# Altium schematic sheet IcantFindFileName.SchDoc
size A4; SheetNumber: 5; SheetTotal: 5
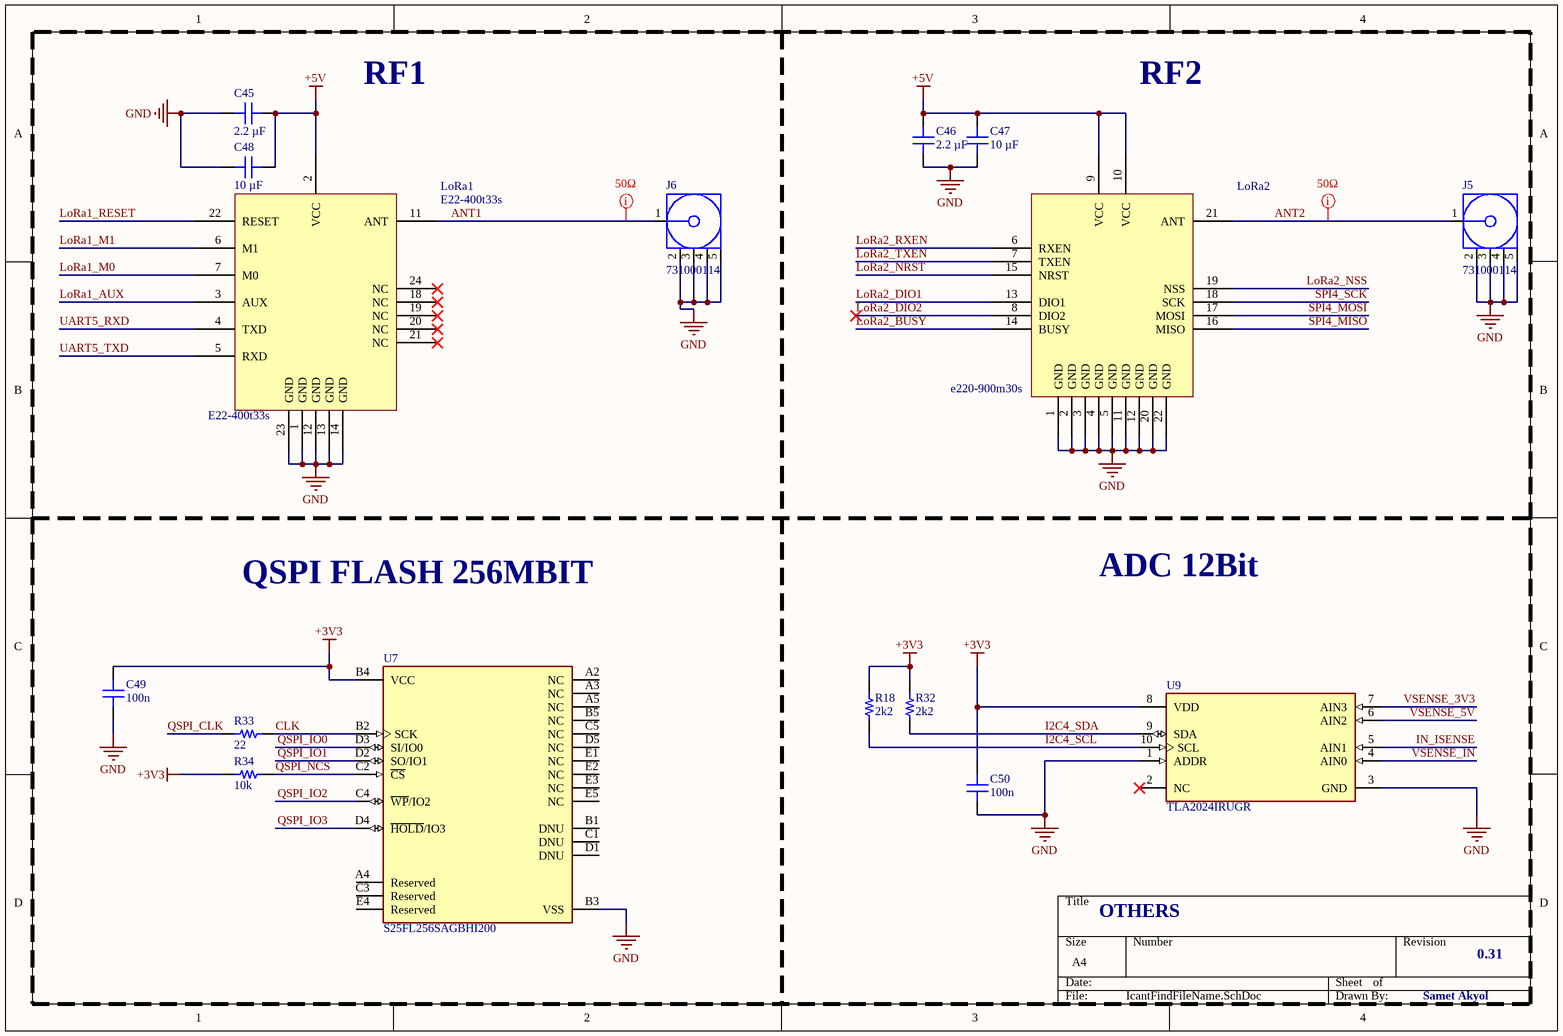
[diagram p0: IcantFindFileName.SchDoc]

## Parts
C45  2.2 µF  [CAP 0805_2012]
C46  2.2 µF  [CAP 0805_2012]
C47  10 µF  [CAP 0805_2012]
C48  10 µF  [CAP 0805_2012]
C49  100n  [CAP 0402_1005]
C50  100n  [CAP 0402_1005]
J5  731000114  [MOLX-731000114_V]
J6  731000114  [MOLX-731000114_V]
LoRa1  E22-400t33s  [E32-433T33S]
LoRa2  e220-900m30s  [PE220-900M30S]
R18  2k2  [RES 0402_1005]
R32  2k2  [RES 0402_1005]
R33  22  [RES 0402_1005]
R34  10k  [RES 0402_1005]
U7  S25FL256SAGBHI200  [FP-002-15534-MFG]
U9  TLA2024IRUGR  [FP-RUG0010A-MFG]

## Nets
+3V3: C49.2 C50.2 R18.2 R32.2 R34.2 U7.B4(VCC) U9.8(VDD)
+5V: C45.2 C46.2 C47.2 C48.2 LoRa1.2(VCC) LoRa2.9(VCC) LoRa2.10(VCC)
GND: C45.1 C46.1 C47.1 C48.1 C49.1 C50.1 J5.2 J5.3 J5.4 J5.5 J6.2 J6.3 J6.4 J6.5 LoRa1.1(GND) LoRa1.12(GND) LoRa1.13(GND) LoRa1.14(GND) LoRa1.23(GND) LoRa2.1(GND) LoRa2.2(GND) LoRa2.3(GND) LoRa2.4(GND) LoRa2.5(GND) LoRa2.11(GND) LoRa2.12(GND) LoRa2.20(GND) LoRa2.22(GND) U7.B3(VSS) U9.1(ADDR) U9.3(GND)
ANT1: J6.1 LoRa1.11(ANT)
ANT2: J5.1 LoRa2.21(ANT)
CLK: R33.2 U7.B2(SCK)
I2C4_SCL: R18.1 U9.10(SCL)
I2C4_SDA: R32.1 U9.9(SDA)
IN_ISENSE: U9.5(AIN1)
LoRa1_AUX: LoRa1.3(AUX)
LoRa1_M0: LoRa1.7(M0)
LoRa1_M1: LoRa1.6(M1)
LoRa1_RESET: LoRa1.22(RESET)
LoRa2_BUSY: LoRa2.14(BUSY)
LoRa2_DIO1: LoRa2.13(DIO1)
LoRa2_DIO2: LoRa2.8(DIO2)
LoRa2_NRST: LoRa2.15(NRST)
LoRa2_NSS: LoRa2.19(NSS)
LoRa2_RXEN: LoRa2.6(RXEN)
LoRa2_TXEN: LoRa2.7(TXEN)
QSPI_CLK: R33.1
QSPI_IO0: U7.D3(SI/IO0)
QSPI_IO1: U7.D2(SO/IO1)
QSPI_IO2: U7.C4(~{WP}/IO2)
QSPI_IO3: U7.D4(~{HOLD}/IO3)
QSPI_NCS: R34.1 U7.C2(~{CS})
SPI4_MISO: LoRa2.16(MISO)
SPI4_MOSI: LoRa2.17(MOSI)
SPI4_SCK: LoRa2.18(SCK)
UART5_RXD: LoRa1.4(TXD)
UART5_TXD: LoRa1.5(RXD)
VSENSE_3V3: U9.7(AIN3)
VSENSE_5V: U9.6(AIN2)
VSENSE_IN: U9.4(AIN0)

Not connected (* = marked no-connect by the designer): LoRa1 18(NC)* 19(NC)* 20(NC)* 21(NC)* 24(NC)*; U7 A2(NC) A3(NC) A4(Reserved) A5(NC) B1(DNU) B5(NC) C1(DNU) C3(Reserved) C5(NC) D1(DNU) D5(NC) E1(NC) E2(NC) E3(NC) E4(Reserved) E5(NC); U9 2(NC)*

## Layout directives
mark named 50Ω: ANT1, ANT2

## Notes on the sheet
- RF1
- RF2
- ADC 12Bit <www.google.com>
- QSPI FLASH 256MBIT
- OTHERS
- 0.31
- Samet Akyol

## Library data of the parts
C45 C46 = TMK212B7225MG-TR: CAP CER 2.2UF 25V X7R 0805; manufacturer: Taiyo Yuden; Tolerance: ±20%; Part Number: TMK212B7225MG-TR; Value: 2.2 µF; Applications: SMPS Filtering; Capacitance: 2.2 µF; componentlink1description: Datasheet; componentlink1url: https://www.yuden.co.jp/productdata/catalog/mlcc01_e.pdf; componentlink2description: DigiKey Link; componentlink2url: https://www.digikey.com/en/products/detail/taiyo-yuden/TMK212B7225MG-TR/6563525; Device Package: 0805 (2012 Metric); lastupdated: 9.02.2024 20:16:05; Lifecycle Status: Active; Minimum Order: 1; Mounting Type: Surface Mount, MLCC; Operating Temperature: -55°C ~ 125°C; Package / Case: 0805 (2012 Metric); packaging: TapeAndReel; partid: 3807; Part Status: Active; price: 0.04; series: M; Size / Dimension: 0.079" L x 0.049" W (2.00mm x 1.25mm); Supplier 1: DigiKey; Supplier Part Number 1: 587-4932-1-ND; Temperature Coefficient: X7R; Thickness (Max): 0.053" (1.35mm); Voltage - Rated: 25V
C47 C48 = C2012X6S1C106K125AC: CAP CER 10UF 16V X6S 0805; manufacturer: TDK Corporation; Tolerance: ±10%; Part Number: C2012X6S1C106K125AC; Value: 10 µF; Applications: General Purpose; Capacitance: 10 µF; componentlink1description: Datasheet; componentlink1url: https://product.tdk.com/info/en/catalog/datasheets/mlcc_commercial_general_en.pdf?ref_disty=digikey; componentlink2description: DigiKey Link; componentlink2url: https://www.digikey.com/en/products/detail/tdk-corporation/C2012X6S1C106K125AC/2733046; Device Package: 0805 (2012 Metric); Features: Low ESL; lastupdated: 9.02.2024 20:16:08; Lifecycle Status: Active; Minimum Order: 1; Mounting Type: Surface Mount, MLCC; Operating Temperature: -55°C ~ 105°C; Package / Case: 0805 (2012 Metric); packaging: TapeAndReel; partid: 2995; Part Status: Active; price: 0.06; series: C; Size / Dimension: 0.079" L x 0.049" W (2.00mm x 1.25mm); Supplier 1: DigiKey; Supplier Part Number 1: 445-7611-1-ND; Temperature Coefficient: X6S; Thickness (Max): 0.057" (1.45mm); Voltage - Rated: 16V
C49 C50 = CL05B104KP5VPNC: CAP CER 100NF 10V X7R 0402; manufacturer: Samsung Electro-Mechanics; Capacitance: 0.1 µF; Tolerance: ±10%; Part Number: CL05B104KP5VPNC; Value: 100n; Applications: Automotive; componentlink1description: Datasheet; componentlink1url: https://mm.digikey.com/Volume0/opasdata/d220001/medias/docus/5458/CL05B104KP5VPNC_Spec.pdf; componentlink2description: DigiKey Link; componentlink2url: https://www.digikey.com/en/products/detail/samsung-electro-mechanics/CL05B104KP5VPNC/20498482; Device Package: 0402 (1005 Metric); lastupdated: 9.02.2024 20:03:17; Lifecycle Status: Active; Minimum Order: 1; Mounting Type: Surface Mount, MLCC; Operating Temperature: -55°C ~ 125°C; Package / Case: 0402 (1005 Metric); packaging: TapeAndReel; partid: 56690; price: 0.01; Ratings: AEC-Q200; series: CL; Size / Dimension: 0.039" L x 0.020" W (1.00mm x 0.50mm); Supplier 1: DigiKey; Supplier Part Number 1: 1276-CL05B104KP5VPNCCT-ND; Temperature Coefficient: X7R; Thickness (Max): 0.022" (0.55mm); Voltage - Rated: 10V
J5 J6 = CMP-2000-05487-1: SMA Right-Angle PCB Jack Receptacle, Brass Body, Gold Plated, 50 Ohm, 5-Pin THD, RoHS, Tray; Manufacturer: Molex; Datasheet Version: 09/2016; Package Description: 5-Pin Through Hole Device, Body 14.8 x 6.35 mm, Pitch 2.54 mm; Datasheet URL: http://www.molex.com/webdocs/datasheets/pdf/en-us/0731000114_RF_COAX_CONNECTORS.pdf; Manufacturer URL: http://www.molex.com/; Package Reference: 731000114; Mounting Technology: ThroughHole; Package URL: http://www.molex.com/pdm_docs/sd/731000114_sd.pdf
LoRa1 = LoRa: (UART) based on SEMTECH's LoRa solution, with an operating frequency of 410.125~493.125MHz (default 433.125MHz), TTL level output, and is compatible with 3.3V and 5V IO port voltages.
LoRa2 = LoRaE220-900m30s: 1W module developed independently based on new generation of LoRa RF chip LLCC68 from Semtech. LLCC68 is suitable for 868MHz/915MHz
R18 R32 R34 = RP73PF1E10KBTD: RES 10K OHM 0.1% 1/10W 0402; Manufacturer: TE Connectivity Passive Product; Power (Watts): 0.1W, 1/10W; Resistance: 10 kOhms; Temperature Coefficient: ±25ppm/°C; Part Number: RP73PF1E10KBTD; ComponentLink1Description: Datasheet; ComponentLink1URL: https://www.te.com/commerce/DocumentDelivery/DDEController?Action=srchrtrv&DocNm=1773272&DocType=DS&DocLang=English; ComponentLink2Description: DigiKey Link; ComponentLink2URL: https://www.digikey.com/en/products/detail/te-connectivity-passive-product/RP73PF1E10KBTD/8260957; Composition: Thin Film; Device Package: 0402 (1005 Metric); Height - Seated (Max): 0.014" (0.35mm); LastUpdated: 9.02.2024 20:30:24; Lifecycle Status: Active; Minimum Order: 1; Number of Terminations: 2; Operating Temperature: -55°C ~ 155°C; Package / Case: 0402 (1005 Metric); Packaging: TapeAndReel; PartId: 2434; Part Status: Active; Price: 0.08; Series: RP73, Holsworthy; Size / Dimension: 0.039" L x 0.020" W (1.00mm x 0.50mm); Supplier 1: DigiKey; Supplier Part Number 1: A127415CT-ND; Supplier Device Package: 0402; Tolerance: ±0.1%
  R18 R32: Value: 2k2
  R34: Value: 10k
R33 = ERA-2AKD220X: RES SMD 22 OHM 0.5% 1/16W 0402; Manufacturer: Panasonic Electronic Components; Power (Watts): 0.063W, 1/16W; Resistance: 22 Ohms; Temperature Coefficient: ±100ppm/°C; Part Number: ERA-2AKD220X; Value: 22; ComponentLink1Description: Datasheet; ComponentLink1URL: https://industrial.panasonic.com/cdbs/www-data/pdf/RDM0000/AOA0000C307.pdf; ComponentLink2Description: DigiKey Link; ComponentLink2URL: https://www.digikey.com/en/products/detail/panasonic-electronic-components/ERA-2AKD220X/1706062; Composition: Thin Film; Device Package: 0402 (1005 Metric); Features: Automotive AEC-Q200; Height - Seated (Max): 0.016" (0.40mm); LastUpdated: 9.02.2024 20:30:21; Lifecycle Status: Active; Minimum Order: 1; Number of Terminations: 2; Operating Temperature: -55°C ~ 155°C; Package / Case: 0402 (1005 Metric); Packaging: TapeAndReel; PartId: 3170; Part Status: Active; Price: 0.02; Ratings: AEC-Q200; Series: ERA-2A; Size / Dimension: 0.039" L x 0.020" W (1.00mm x 0.50mm); Supplier 1: DigiKey; Supplier Part Number 1: P22DDCT-ND; Supplier Device Package: 0402; Tolerance: ±0.5%
U7 = CMP-12948-000001-1: IC FLASH 256M SPI 133MHZ 24BGA; Manufacturer: Cypress Semiconductor; Standoff Height: 0.2mm; Memory Type: FLASH,NOR; Nominal Supply Current: 16-100mA; Memory Size: 256Mbits; Access Time: 8ns; Min Supply Voltage: 1.65V; Max Supply Voltage: 3.8V; Lead Free: Yes; RoHS: TRUE; Interface: SPI; Package: 002-15534; ComponentLink2Description: Datasheet; Footprint Url: https://www.cypress.com/file/217366/download; ComponentLink2URL: https://www.cypress.com/file/448601/download; Ambient Temperature Range High: +85°C; Device Class L1: Integrated Circuits (ICs); Category: IC; Device Class L3: Flash; Manufacturer Part Number: S25FL256SAGBHI200; Temperature: -40°C to +85°C; Ambient Temperature Range Low: -40°C; Temperature Range Low: -40°C; Height: 1.2mm; Digikey Description: IC FLASH 256M SPI 133MHZ 24BGA; Octopart: https://octopart.com/s25fl256sagbhi200-cypress+semiconductor-65153244; Temperature Range High: +85°C; Automotive: No; Device Class L2: Memory; Ipc Land Pattern Name: BGA25N100P5X5_800X600X120; Frequency: 133MHz
U9 = CMP-04860-000013-1: IC ADC 12BIT SIGMA-DELTA 10X2QFN; Number of A/D Converters: 1; Interface: I2C; Number of Bits: 12; Sampling Rate: 3300S/s; Number of Inputs: 4; Mount: Surface Mount; Max Operating Temperature: 85°C; Min Operating Temperature: -40°C; RoHS Compliant: Yes; Packaging: Tape and Reel